# EAGLE design var_state_eq (EAGLE 9.5.2)
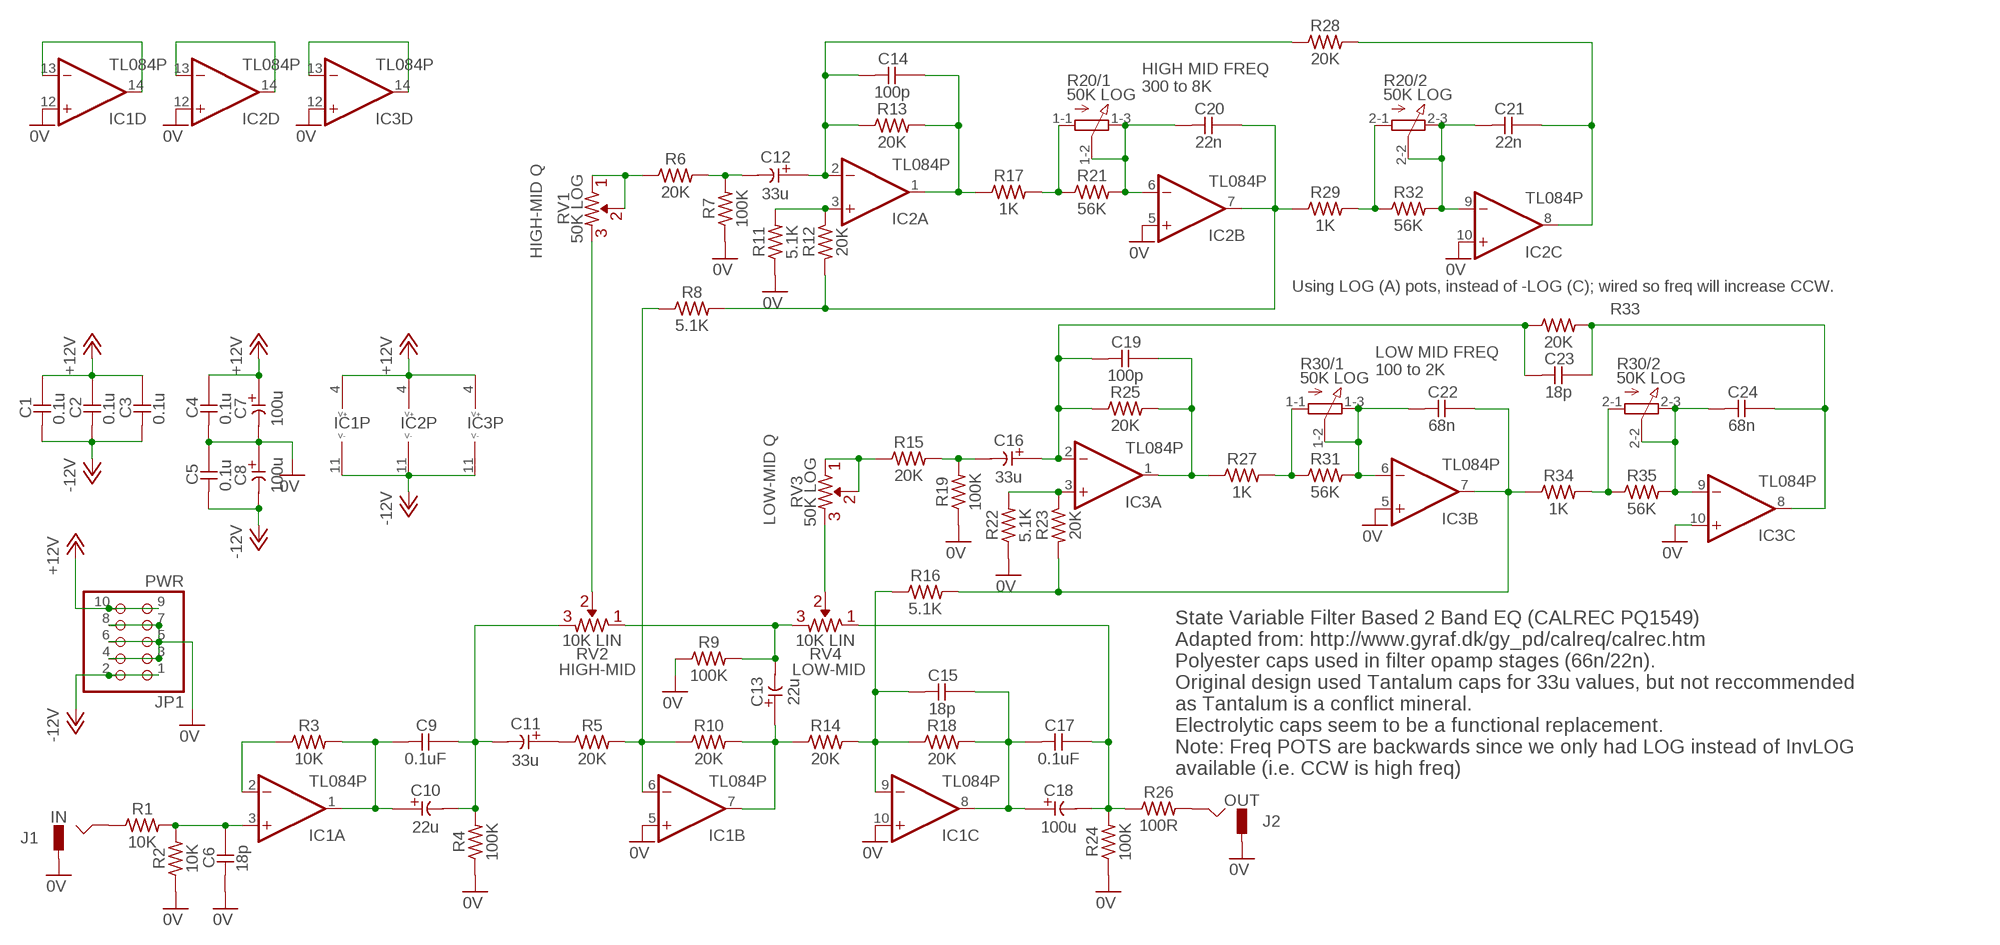
[diagram p0: schematic, sheet 1]

## Parts
C1  0.1u  CC-US025-024X044  [C025-024X044]
C2  0.1u  CC-US025-024X044  [C025-024X044]
C3  0.1u  CC-US025-024X044  [C025-024X044]
C4  0.1u  CC-US025-024X044  [C025-024X044]
C5  0.1u  CC-US025-024X044  [C025-024X044]
C6  18p  CC-US025-024X044  [C025-024X044]
C7  100u  CE-USE5-8.5  [E5-8,5]
C8  100u  CE-USE5-8.5  [E5-8,5]
C9  0.1uF  CC-US025-024X044  [C025-024X044]
C10  22u  CE-USE2-5  [E2-5]
C11  33u  CE-USE2-5  [E2-5]
C12  33u  CE-USE2-5  [E2-5]
C13  22u  CE-USE2-5  [E2-5]
C14  100p  CC-US025-024X044  [C025-024X044]
C15  18p  CC-US025-024X044  [C025-024X044]
C16  33u  CE-USE2-5  [E2-5]
C17  0.1uF  CC-US025-024X044  [C025-024X044]
C18  100u  CE-USE5-8.5  [E5-8,5]
C19  100p  CC-US025-024X044  [C025-024X044]
C20  22n  CC-US050-024X044  [C050-024X044]
C21  22n  CC-US050-024X044  [C050-024X044]
C22  68n  CC-US050-024X044  [C050-024X044]
C23  18p  CC-US025-024X044  [C025-024X044]
C24  68n  CC-US050-024X044  [C050-024X044]
IC1  TL084P  [DIL14]
IC2  TL084P  [DIL14]
IC3  TL084P  [DIL14]
J1  IN  JACK-M  [JACK-M]
J2  OUT  JACK-M  [JACK-M]
JP1  PWR  PINHD-2X5  [2X05]
R1  10K  R  [0207/7]
R2  10K  R  [0207/7]
R3  10K  R  [0207/7]
R4  100K  R  [0207/7]
R5  20K  R  [0207/7]
R6  20K  R  [0207/7]
R7  100K  R  [0207/7]
R8  5.1K  R  [0207/7]
R9  100K  R  [0207/7]
R10  20K  R  [0207/7]
R11  5.1K  R  [0207/7]
R12  20K  R  [0207/7]
R13  20K  R  [0207/7]
R14  20K  R  [0207/7]
R15  20K  R  [0207/7]
R16  5.1K  R  [0207/7]
R17  1K  R  [0207/7]
R18  20K  R  [0207/7]
R19  100K  R  [0207/7]
R20  50K LOG  3RP/1610G  [3RP/1610G]
R21  56K  R  [0207/7]
R22  5.1K  R  [0207/7]
R23  20K  R  [0207/7]
R24  100K  R  [0207/7]
R25  20K  R  [0207/7]
R26  100R  R  [0207/7]
R27  1K  R  [0207/7]
R28  20K  R  [0207/7]
R29  1K  R  [0207/7]
R30  50K LOG  3RP/1610G  [3RP/1610G]
R31  56K  R  [0207/7]
R32  56K  R  [0207/7]
R33  20K  R  [0207/7]
R34  1K  R  [0207/7]
R35  56K  R  [0207/7]
RV1  50K LOG  R-VAR-PANEL  [R-VAR-PANEL]
RV2  10K LIN  R-VAR-PANEL  [R-VAR-PANEL]
RV3  50K LOG  R-VAR-PANEL  [R-VAR-PANEL]
RV4  10K LIN  R-VAR-PANEL  [R-VAR-PANEL]

## Nets
0V [power]: C4.2 C5.1 C6.2 C7.- C8.+ IC1.5(B:+IN) IC1.10(C:+IN) IC1.12(D:+IN) IC2.5(B:+IN) IC2.10(C:+IN) IC2.12(D:+IN) IC3.5(B:+IN) IC3.10(C:+IN) IC3.12(D:+IN) J1.GND J2.GND JP1.3 JP1.4 JP1.5 JP1.6 JP1.7 JP1.8 R2.1 R4.1 R7.1 R9.1 R11.1 R19.1 R22.1 R24.1
+12V [power]: C1.1 C2.1 C3.1 C4.1 C7.+ IC1.4(P:V+) IC2.4(P:V+) IC3.4(P:V+) JP1.9 JP1.10
-12V [power]: C1.2 C2.2 C3.2 C5.2 C8.- IC1.11(P:V-) IC2.11(P:V-) IC3.11(P:V-) JP1.1 JP1.2
N$1: IC1.13(D:-IN) IC1.14(D:OUT)
N$2: IC2.13(D:-IN) IC2.14(D:OUT)
N$3: IC3.13(D:-IN) IC3.14(D:OUT)
N$4: C11.+ R5.1
N$5: J1.HOT R1.1
N$6: IC1.2(A:-IN) R3.1
N$7: C13.- R9.2 RV2.R1 RV4.R2
N$8: C9.1 C10.- C11.- R4.2 RV2.R2
N$9: C6.1 IC1.3(A:+IN) R1.2 R2.2
N$10: C13.+ IC1.7(B:OUT) R10.2 R14.1
N$11: C9.2 C10.+ IC1.1(A:OUT) R3.2
N$12: RV1.R2 RV2.VAR
N$13: IC1.6(B:-IN) R5.2 R8.1 R10.1
N$14: J2.HOT R26.2
N$15: C15.2 IC1.9(C:-IN) R14.2 R16.1 R18.1
N$16: C17.1 C18.- R24.2 R26.1 RV4.R1
N$17: R6.1 RV1.R1 RV1.VAR
N$18: C15.1 C17.2 C18.+ IC1.8(C:OUT) R18.2
N$19: C12.- R6.2 R7.2
N$20: C12.+ C14.2 IC2.2(A:-IN) R13.1 R28.1
N$21: C14.1 IC2.1(A:OUT) R13.2 R17.1
N$22: R17.2 R20.1-1(/1:A) R21.1
N$23: C20.2 IC2.6(B:-IN) R20.1-2(/1:S) R20.1-3(/1:E) R21.2
N$24: R20.2-1(/2:A) R29.2 R32.1
N$25: C20.1 IC2.7(B:OUT) R8.2 R12.2 R29.1
N$26: RV3.R2 RV4.VAR
N$27: C21.2 IC2.9(C:-IN) R20.2-2(/2:S) R20.2-3(/2:E) R32.2
N$28: C21.1 IC2.8(C:OUT) R28.2
N$29: IC3.3(A:+IN) R22.2 R23.1
N$30: R15.1 RV3.R1 RV3.VAR
N$31: C16.- R15.2 R19.2
N$32: C16.+ C19.2 C23.2 IC3.2(A:-IN) R25.1 R33.1
N$33: C22.1 IC3.7(B:OUT) R16.2 R23.2 R34.1
N$34: C19.1 IC3.1(A:OUT) R25.2 R27.1
N$35: R27.2 R30.1-1(/1:A) R31.1
N$36: C22.2 IC3.6(B:-IN) R30.1-2(/1:S) R30.1-3(/1:E) R31.2
N$37: R30.2-1(/2:A) R34.2 R35.1
N$38: C24.2 IC3.9(C:-IN) R30.2-2(/2:S) R30.2-3(/2:E) R35.2
N$39: C23.1 C24.1 IC3.8(C:OUT) R33.2
N$40: IC2.3(A:+IN) R11.2 R12.1

## Notes on the sheet
- HIGH MID FREQ
  300 to 8K
- HIGH-MID Q
- Using LOG (A) pots, instead of -LOG (C); wired so freq will increase CCW.
- LOW MID FREQ
  100 to 2K
- LOW-MID Q
- HIGH-MID | LOW-MID
- State Variable Filter Based 2 Band EQ (CALREC PQ1549)
  Adapted from: http://www.gyraf.dk/gy_pd/calreq/calrec.htm
  Polyester caps used in filter opamp stages (66n/22n).
  Original design used Tantalum caps for 33u values, but not reccommended 
  as Tantalum is a conflict mineral.
  Electrolytic caps seem to be a functional replacement.
  Note: Freq POTS are backwards since we only had LOG instead of InvLOG
  available (i.e. CCW is high freq)

## Library data of the parts
C1-C6 C9 C14 C15 C17 C19-C24 = _common:CC-US: CAPACITOR, US symbol
C7 C8 C10-C13 C16 C18 = _common:CE-US: ELECTROLYTIC CAPACITOR, US symbol
IC1-IC3 = _common:TL084: OP AMP
J1 J2 = _common:JACK-M
JP1 = pinhead:PINHD-2X5: PIN HEADER
R1-R19 R21-R29 R31-R35 = _common:R: RESISTOR, US symbol
R20 R30 = _common:3RP/1610G: Generic two level pot.
RV1-RV4 = _common:R-VAR-PANEL: Panel mounted pot

## Net classes
0 default: width 0.406 mm
1 power: width 0.813 mm

## Board
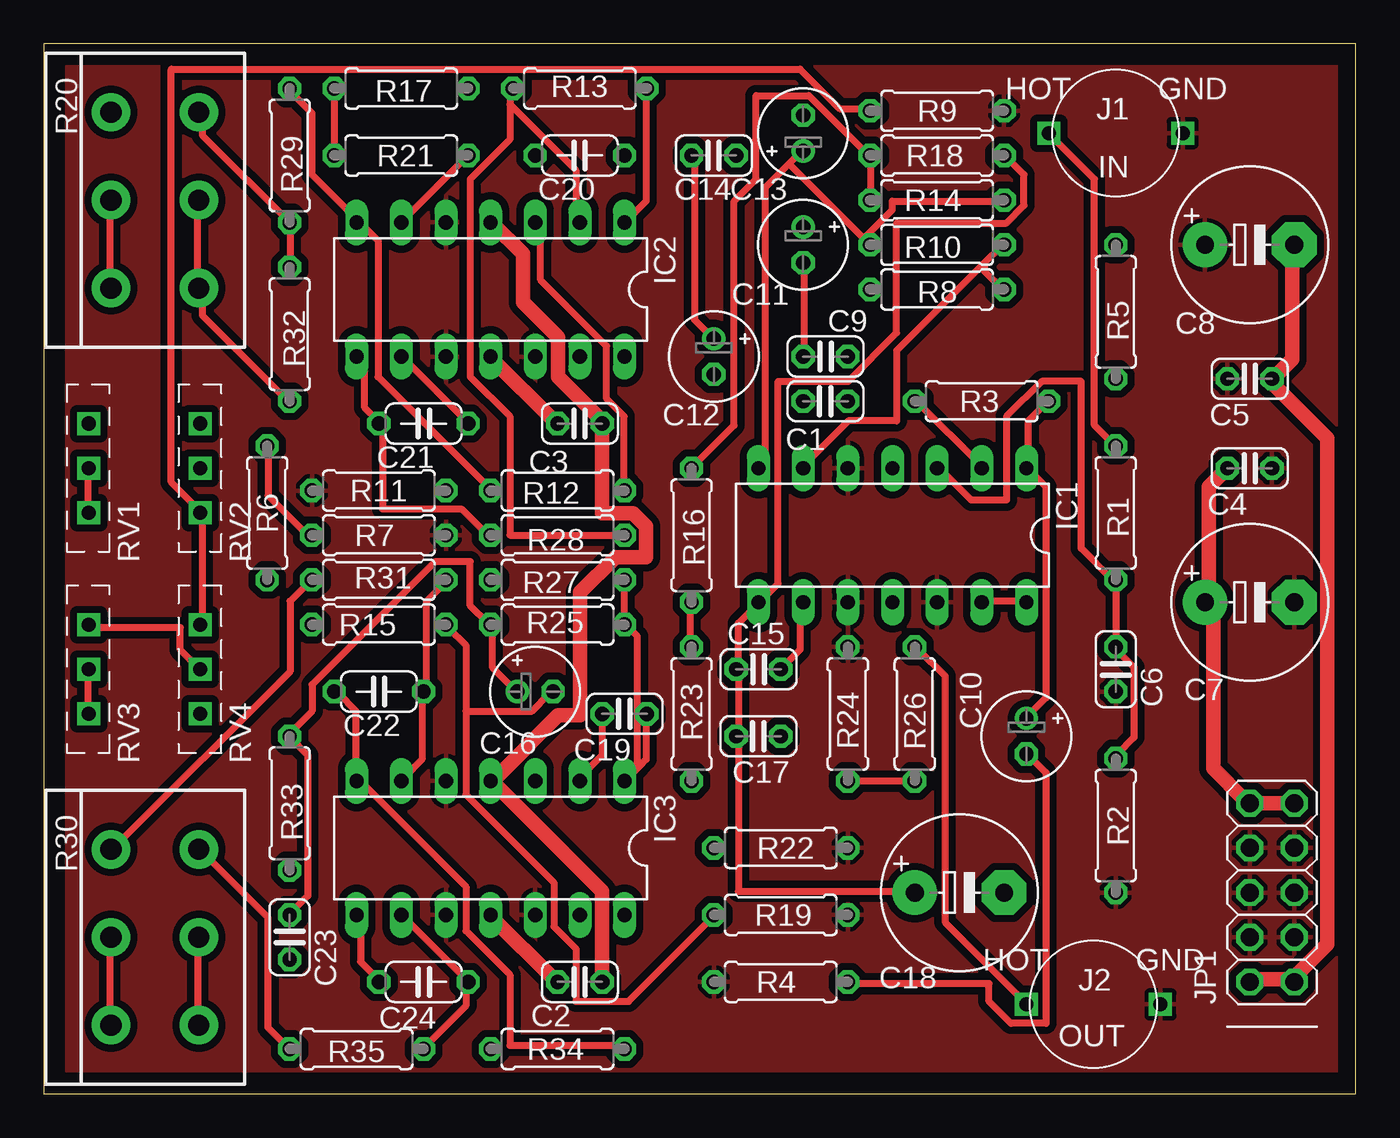
[diagram p1: board, top side]
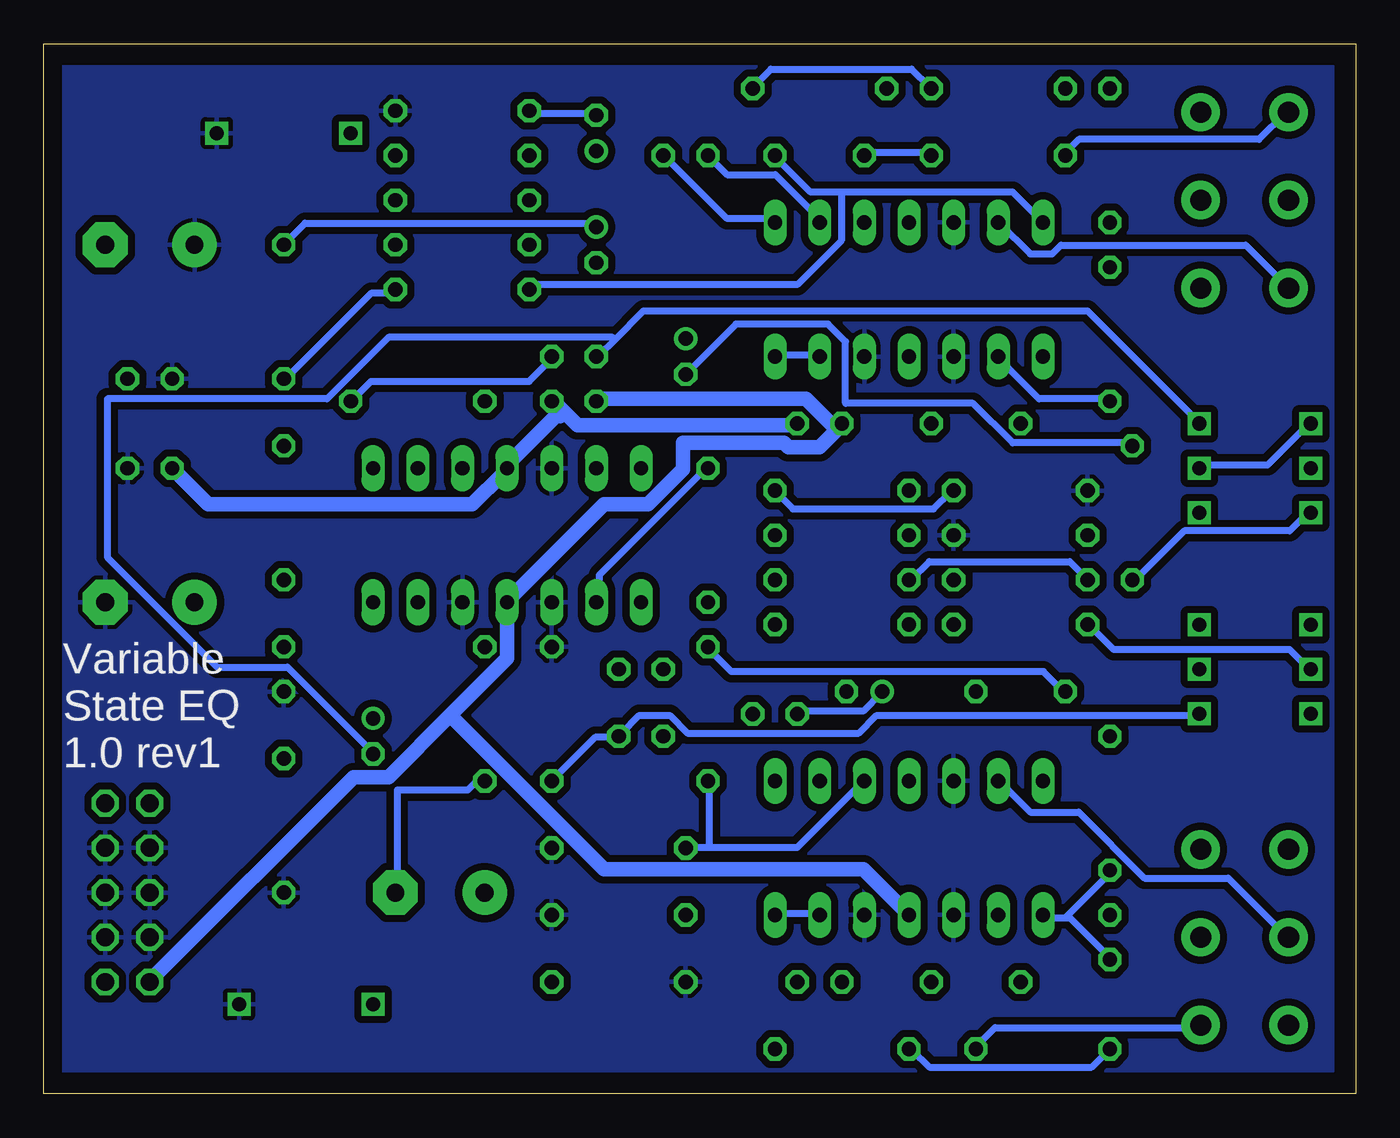
[diagram p2: board, bottom side, seen from below]

Size 74.6 x 59.68 mm. Coordinates in mm from the lower left corner, seen from the top.
Outline: 0,0 74.6,0 74.6,59.68 0,59.68 0,0
Copper layers (1*16): Top 0.035mm / dielectric 1.5mm / Bottom 0.035mm
Design rules "default": minimum track width 6mil, minimum drill 0.35mm, track to track 6mil, track to pad 6mil, pad to pad 6mil, via to via 6mil, smd to smd 6mil, copper to edge 40mil, drill to drill 6mil, minimum pad ring 10mil, minimum via ring 8mil, stop-mask expansion 4mil, vias tented up to drill 0mil, thermal gap 10mil

### Footprints (pad centres in the part's own frame; a part is rotated, then mirrored left to right if it is on the bottom)
C025-024X044 = drill 0.813 octagon: 1 -1.27,0; 2 1.27,0
E5-8,5 = drill 1.016 pad 2.54: + -2.54,0 | drill 1.016 pad 2.54 octagon: - 2.54,0
E2-5 = drill 0.813 pad 1.27: + -1.016,0 | drill 0.813 pad 1.27 octagon: - 1.016,0
C050-024X044 = drill 0.813 octagon: 1 -2.54,0; 2 2.54,0
DIL14 = drill 0.813 long: 1 -7.62,-3.81; 2 -5.08,-3.81; 3 -2.54,-3.81; 4 0,-3.81; 5 2.54,-3.81; 6 5.08,-3.81; 7 7.62,-3.81; 8 7.62,3.81; 9 5.08,3.81; 10 2.54,3.81; 11 0,3.81; 12 -2.54,3.81; 13 -5.08,3.81; 14 -7.62,3.81
JACK-M = drill 0.8 square: GND -3.81,0; HOT 3.81,0
2X05 = drill 1.016 octagon: 1 -5.08,-1.27; 2 -5.08,1.27; 3 -2.54,-1.27; 4 -2.54,1.27; 5 0,-1.27; 6 0,1.27; 7 2.54,-1.27; 8 2.54,1.27; 9 5.08,-1.27; 10 5.08,1.27
0207/7 = drill 0.813 octagon: 1 -3.81,0; 2 3.81,0
3RP/1610G = drill 1.2 pad 2.184: 1-1 -5,0; 1-2 0,0; 1-3 5,0; 2-1 -5,5; 2-2 0,5; 2-3 5,5
R-VAR-PANEL = drill 0.8 square: R1 -2.54,0; R2 2.54,0; VAR 0,0

### Placement (x,y rotation side)
C1  44.45,39.37 180 top
C2  30.48,6.35 180 top
C3  30.48,38.1 180 top
C4  68.58,35.56 0 top
C5  68.58,40.64 0 top
C6  60.96,24.13 270 top
C7  68.58,27.94 0 top
C8  68.58,48.26 0 top
C9  100n  [C025-024X044]  44.45,41.91 0 top
C10  55.88,20.32 270 top
C11  43.18,48.26 270 top
C12  38.1,41.91 270 top
C13  43.18,54.61 90 top
C14  38.1,53.34 180 top
C15  40.64,24.13 0 top
C16  27.94,22.86 0 top
C17  100n  [C025-024X044]  40.64,20.32 180 top
C18  52.07,11.43 0 top
C19  33.02,21.59 180 top
C20  30.48,53.34 180 top
C21  21.59,38.1 0 top
C22  19.05,22.86 0 top
C23  13.97,8.89 90 top
C24  21.59,6.35 0 top
IC1  48.26,31.75 180 top
IC2  25.4,45.72 180 top
IC3  25.4,13.97 180 top
J1  60.96,54.61 180 top
J2  59.69,5.08 180 top
JP1  69.85,11.43 90 top
R1  60.96,33.02 270 top
R2  60.96,15.24 90 top
R3  53.34,39.37 0 top
R4  41.91,6.35 0 top
R5  60.96,44.45 270 top
R6  12.7,33.02 90 top
R7  19.05,31.75 180 top
R8  50.8,45.72 180 top
R9  50.8,55.88 180 top
R10  50.8,48.26 180 top
R11  19.05,34.29 0 top
R12  29.21,34.29 180 top
R13  30.48,57.15 0 top
R14  50.8,50.8 180 top
R15  19.05,26.67 0 top
R16  36.83,31.75 270 top
R17  20.32,57.15 180 top
R18  50.8,53.34 0 top
R19  41.91,10.16 180 top
R20  3.81,50.8 270 top
R21  20.32,53.34 0 top
R22  41.91,13.97 180 top
R23  36.83,21.59 90 top
R24  45.72,21.59 270 top
R25  29.21,26.67 0 top
R26  49.53,21.59 90 top
R27  29.21,29.21 180 top
R28  29.21,31.75 180 top
R29  13.97,53.34 270 top
R30  3.81,8.89 270 top
R31  19.05,29.21 0 top
R32  13.97,43.18 270 top
R33  13.97,16.51 270 top
R34  29.21,2.54 180 top
R35  17.78,2.54 0 top
RV1  2.54,35.56 90 top
RV2  8.89,35.56 90 top
RV3  2.54,24.13 90 top
RV4  8.89,24.13 90 top

### Tracks (layer width: path | path; a pad name or v marks a point on that pad's centre or on a via)
0V
  pour Top (isolate 0.406): 1.27,58.42 73.66,58.42 73.66,1.27 1.27,1.27
  pour Bottom (isolate 0.406): 1.27,58.42 73.66,58.42 73.66,1.27 1.27,1.27
+12V
  Top 0.813: JP1.9 71,16.5 68.75,16.5 JP1.10 68.25,16.75 66.5,18.5 66.5,27.75 C7.+ 66.25,28 66.25,34.5 C4.1 | C2.1 31.75,11.5 25.5,17.75 IC3.4 25.75,18 29.25,21.5 30.5,21.5 30.5,28.5 32.5,30.5 34.25,30.5 34.25,32.25 33.5,33 31.75,33 C3.1 31.75,38.25 29.25,40.75 29.25,43 27.25,45 27.25,47.75 25.5,49.5 IC2.4
  Bottom 0.813: 45,38.75 45.5,39.25 C1.1 | 45,38.75 44.25,38 31.75,38 C3.1 | 45,38.75 45.25,38.5 45.5,38.5 48.25,35.75 IC1.4 48.5,35.25 50.25,33.5 65.25,33.5 C4.1
-12V
  Top 0.813: C8.- 71,48.25 71,41.75 70,40.75 C5.2 70,40.25 73,37.25 73,8.5 71.25,6.75 JP1.1 71,6.5 68.75,6.5 JP1.2 | C2.2 29,6.5 25.5,10 IC3.11 | IC2.11 25.5,41.75 29,38.25 C3.2
  Bottom 0.813: C1.2 43,39.5 31.25,39.5 29.75,38 C3.2 29.25,38 30.5,36.75 32.25,36.75 32.5,37 38.25,37 38.25,35.5 40.25,33.5 42.75,33.5 48.25,28 IC1.11 48.25,27.75 48.25,24.75 51.5,21.5 | 51.5,21.5 55,18 57,18 68.5,6.5 JP1.2 | 51.5,21.5 42.75,12.75 28,12.75 25.5,10.25 IC3.11
N$1
  Top 0.406: IC1.13 53.5,28 55.75,28 IC1.14
N$2
  Bottom 0.406: IC2.13 30.5,42 33,42 IC2.14
N$3
  Bottom 0.406: IC3.13 30.5,10.25 33,10.25 IC3.14
N$4
  Bottom 0.406: C11.+ 43.25,49.5 59.75,49.5 60.75,48.5 R5.1
N$5
  Top 0.406: J1.HOT 57.25,54.5 59.75,52 59.75,38 60.75,37 R1.1
N$6
  Top 0.406: R3.1 49.75,39.25 53.25,35.75 IC1.2
N$7
  Top 0.406: RV4.R2 9,26.75 9,33 RV2.R1 8.75,33.25 7.25,34.75 7.25,58.25 43,58.25 45.25,56 46.75,56 R9.2
  Bottom 0.406: C13.- 43.25,55.75 46.75,55.75 R9.2
N$8
  Top 0.406: R4.2 45.75,6.25 53.75,6.25 53.75,5.25 55,4 57,4 57,18.25 56,19.25 C10.- | C11.- 43.25,47 43.25,42 C9.1
  Bottom 0.406: 42.12,42.88 43,42 C9.1 | 42.12,42.88 40.5,44.5 15.25,44.5 9,38.25 RV2.R2 | C10.- 56,19.5 60.75,24.25 64.75,24.25 71,30.5 71,39.5 58.5,39.5 55,43 42.25,43 42.12,42.88
N$9
  Top 0.406: R2.2 61,19.25 62,20.25 62,24.25 61,25.25 C6.1 61,25.5 61,29 R1.2 60.75,29.25 59,31 59,40.5 56.75,40.5 54.75,38.5 54.75,33.75 52.75,33.75 51,35.5 IC1.3
N$10
  Top 0.406: 42.38,52.88 43,53.5 C13.+ | 42.38,52.88 41,51.5 41,36 40.75,35.75 IC1.7 | 42.38,52.88 R10.2 46.75,48.75 48.25,50.25 48.25,50.75 54.5,50.75 R14.1
N$11
  Top 0.406: C10.+ 56,21.5 57,22.5 57,34.5 56,35.5 IC1.1 56,35.75 56,38.25 57,39.25 R3.2
  Bottom 0.406: C9.2 45.75,41.75 47,40.5 56,40.5 57,39.5 R3.2
N$12
  Bottom 0.406: RV1.R2 2.75,38 5,35.75 8.75,35.75 RV2.VAR
N$13
  Top 0.406: 53.38,47.12 54.5,48.25 R10.1 | 53.38,47.12 48.5,42.25 48.5,38.25 45.75,38.25 43.25,35.75 IC1.6 | R8.1 54.5,45.75 53.5,46.75 53.5,47 53.38,47.12
  Bottom 0.406: R5.2 60.75,40.75 56,45.5 54.75,45.5 R8.1
N$14
  Top 0.406: J2.HOT 55.75,5.25 51.25,9.75 51.25,23.75 49.75,25.25 R26.2
N$15
  Top 0.406: R14.2 47,51 47,53.25 R18.1 46.75,53.5 43.5,56.75 40.5,56.75 40.5,52 39.25,50.75 39.25,38 37,35.75 R16.1 | C15.2 42,24.25 43,25.25 43,27.75 IC1.9
  Bottom 0.406: R16.1 37,35.5 43,29.5 43,28 IC1.9
N$16
  Top 0.406: R24.2 45.75,17.75 49.5,17.75 R26.1
  Bottom 0.406: RV4.R1 9,21.5 27.25,21.5 28.25,20.5 38,20.5 39,21.5 40.75,21.5 41.75,20.5 C17.1 42,20.25 43.25,20.25 R24.2 | C18.- 54.5,11.5 54.5,17.25 50.5,17.25 50,17.75 49.75,17.75 R26.1
N$17
  Top 0.406: RV1.R1 2.5,33.25 2.5,35.5 RV1.VAR
  Bottom 0.406: R6.1 12.5,29.25 9.75,32 3.75,32 2.75,33 RV1.R1
N$18
  Top 0.406: R18.2 54.75,53.25 55.75,52.25 55.75,50.5 54.75,49.5 48.5,49.5 48.5,43.25 45.75,40.5 41.75,40.5 41.75,29 40.75,28 IC1.8 40.5,27.75 39.5,26.75 39.5,24.25 C15.1 39.5,24 39.5,20.5 C17.2 39.5,20.25 39.5,11.5 49.5,11.5 C18.+
N$19
  Top 0.406: R7.2 15,31.75 12.75,34 12.75,36.75 R6.2
  Bottom 0.406: C12.- 38,41 35.25,43.75 30,43.75 29,42.75 29,39.25 21.75,39.25 19.5,37 12.75,37 R6.2
N$20
  Top 0.406: C12.+ 38,43 37,44 37,53.25 C14.2 | R28.1 26.5,31.75 26.5,38.5 24.25,40.75 24.25,52 26.5,54.25 26.5,56.25 | 26.5,56.25 26.5,57 R13.1 | 26.5,56.25 30.25,52.5 30.25,49.75 IC2.2
  Bottom 0.406: IC2.2 30.5,49.75 33,52.25 35.75,52.25 36.75,53.25 C14.2
N$21
  Top 0.406: IC2.1 33.25,49.75 34.25,50.75 34.25,57 R13.2
  Bottom 0.406: R17.1 24.25,57.25 25.25,58.25 33.25,58.25 34.25,57.25 R13.2 | C14.1 39.25,53.25 35.75,49.75 33.25,49.75 IC2.1
N$22
  Top 0.406: R21.1 16.5,53.5 16.5,57 R17.2
  Bottom 0.406: R21.1 16.5,53.5 15.75,54.25 5.5,54.25 4,55.75 R20.1-1
N$23
  Top 0.406: R20.1-3 3.75,46 3.75,50.75 R20.1-2 | IC2.6 20.5,49.75 24,53.25 R21.2
  Bottom 0.406: C20.2 27.75,53.5 24.25,53.5 R21.2 | R20.1-3 4,46 6.25,48.25 16.75,48.25 17.25,47.75 18.5,47.75 20.25,49.5 IC2.6
N$24
  Top 0.406: R32.1 14,47 14,49.5 R29.2 9,54.5 9,55.75 R20.2-1
N$25
  Top 0.406: R12.2 25.25,34.5 19,40.75 19,48.5 18,49.5 IC2.7 17.75,49.75 15.25,52.25 15.25,55.75 14,57 R29.1
  Bottom 0.406: 29.25,51.25 19.5,51.25 IC2.7 | 29.25,51.25 31,51.25 33,53.25 C20.1 | 29.25,51.25 29.25,48.5 31.75,46 46.5,46 46.75,45.75 R8.2
N$26
  Top 0.406: RV3.R2 2.75,26.5 7.75,26.5 7.75,25.25 8.75,24.25 RV4.VAR
N$27
  Top 0.406: C21.2 24,38.25 20.5,41.75 IC2.9 | R32.2 13.75,39.5 9,44.25 9,45.75 R20.2-3 8.75,46 8.75,50.75 R20.2-2
  Bottom 0.406: IC2.9 20.25,41.75 18,39.5 14,39.5 R32.2
N$28
  Top 0.406: R28.2 25.25,31.75 23.75,33.25 19.25,33.25 19.25,38 C21.1 19,38.25 18.25,39 18.25,41.5 18,41.75 IC2.8
N$29
  Bottom 0.406: 36.75,14 38,14 R22.2 | 36.75,14 31.75,14 28,17.75 IC3.3 | 36.75,14 36.75,17.75 R23.1
N$30
  Top 0.406: RV3.R1 2.5,21.75 2.5,24 RV3.VAR
  Bottom 0.406: R15.1 15,26.5 13.75,25.25 3.75,25.25 2.75,24.25 RV3.VAR
N$31
  Top 0.406: 24,21.75 24,25.5 23,26.5 R15.2 | 24,21.75 24,17 29,12 29,9.5 30.25,8.25 30.25,5.25 33.25,5.25 38,10 R19.2 | 24,21.75 27.75,21.75 28.75,22.75 C16.-
N$32
  Top 0.406: C23.2 14,10.25 15,11.25 15,19.25 14,20.25 R33.1 14,20.5 15.25,21.75 15.25,23.25 22.25,30.25 24.25,30.25 24.25,27.75 25.25,26.75 R25.1 25.5,26.5 25.5,24.25 26.75,23 C16.+ | C19.2 31.75,19.25 30.5,18 IC3.2
  Bottom 0.406: C19.2 31.75,21.75 28,21.75 27,22.75 C16.+
N$33
  Top 0.406: R23.2 36.75,25.5 36.75,27.75 R16.2 | R34.1 33,2.75 26.5,2.75 26.5,6.75 24,9.25 24,11.75 18,17.75 IC3.7 17.75,18 17.75,21.75 16.75,22.75 C22.1
  Bottom 0.406: R23.2 36.75,25.25 35.5,24 17.75,24 16.75,23 C22.1
N$34
  Top 0.406: R27.1 33,29 33,26.75 R25.2 33.25,26.5 33.75,26 33.75,18.75 33.88,18.62 | 33.88,18.62 34.25,19 34.25,21.5 C19.1 | 33.88,18.62 33.25,18 IC3.1
N$35
  Top 0.406: R30.1-1 4,14 14,24 14,28 15,29 R31.1
  Bottom 0.406: R31.1 15.25,29.25 16.25,30.25 24.25,30.25 25.25,29.25 R27.2
N$36
  Top 0.406: R30.1-3 3.75,4 3.75,8.75 R30.1-2 | IC3.6 20.5,18 21.5,19 21.5,22.75 C22.2 21.75,23 21.75,28 22.75,29 R31.2
  Bottom 0.406: R30.1-2 4,9 7.25,12.25 12,12.25 15.75,16 18.5,16 20.25,17.75 IC3.6
N$37
  Top 0.406: R30.2-1 9,13.75 12.75,10 12.75,3.75 13.75,2.75 R35.1
  Bottom 0.406: R35.1 14,2.5 15,1.5 24.25,1.5 25.25,2.5 R34.2
N$38
  Top 0.406: R30.2-3 8.75,4 8.75,8.75 R30.2-2 | R35.2 21.75,2.75 24,5 24,6.25 C24.2 24,6.5 20.5,10 IC3.9
  Bottom 0.406: R30.2-3 9,3.75 20.5,3.75 21.5,2.75 R35.2
N$39
  Top 0.406: C24.1 19,6.5 18,7.5 18,10 IC3.8
  Bottom 0.406: 16.5,10 17.75,10 IC3.8 | 16.5,10 16.25,10 14,7.75 C23.1 | 16.5,10 14,12.5 R33.2
N$40
  Top 0.406: IC2.3 28,49.5 28.25,49.25 28.25,46.25 32,42.5 32,39.5 33,38.5 33,34.5 R12.1
  Bottom 0.406: R11.2 23,34.25 24,33.25 32,33.25 33,34.25 R12.1

### Text on the board
bNames: Variable / State EQ / 1.0 rev1